# EAGLE design usbprog (EAGLE 4.16)
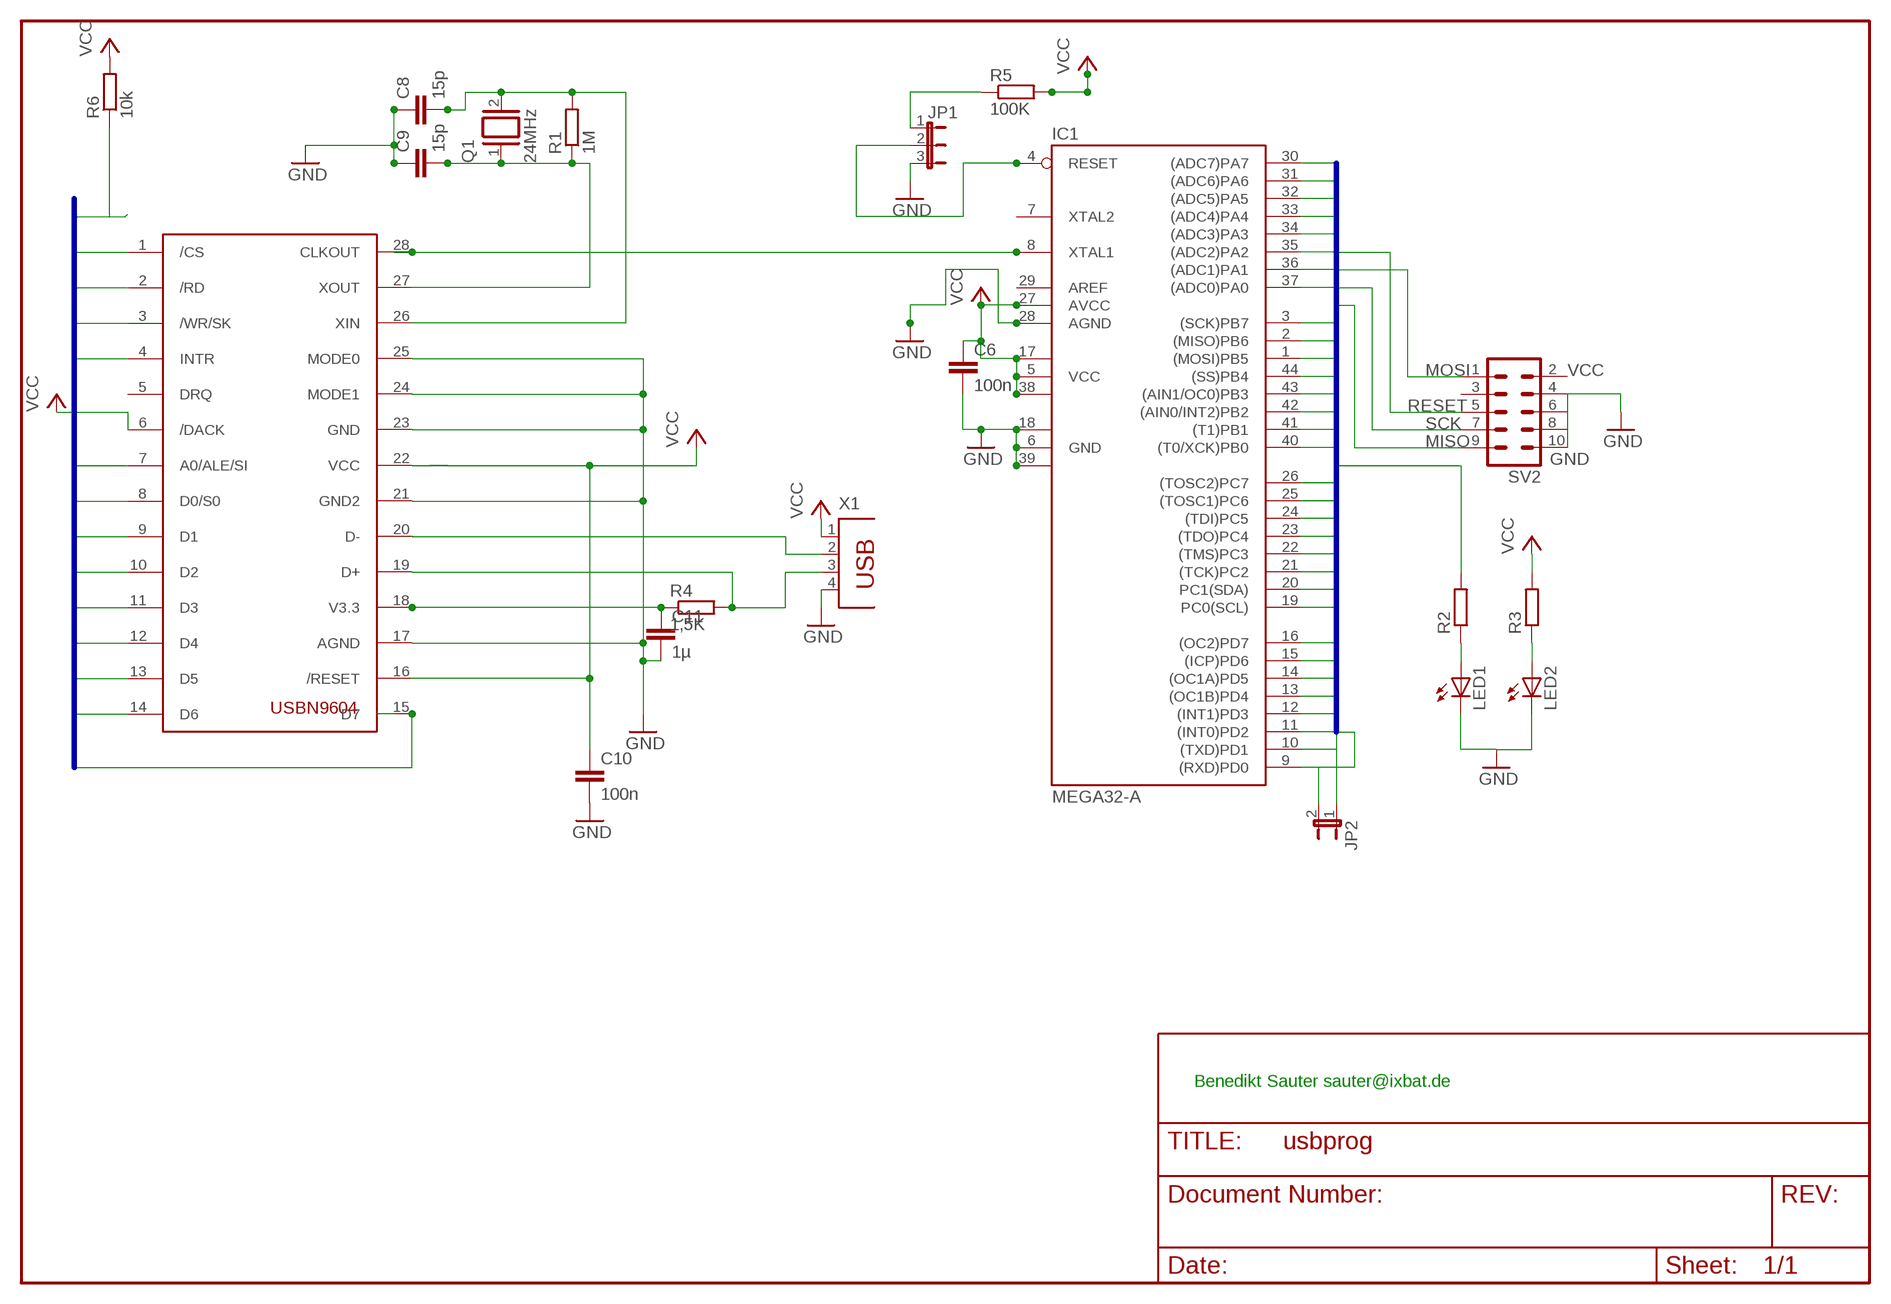
[diagram p0: schematic, sheet 1]

## Parts
C6  100n  C-EUC1206  [C1206]
C8  15p  C-EUC1206  [C1206]
C9  15p  C-EUC1206  [C1206]
C10  100n  C-EUC1206  [C1206]
C11  1µ  C-EUC1206  [C1206]
IC1  MEGA32-A  [TQFP44]
JP1  JP2E  [JP2]
JP2  JP1E  [JP1]
LED1  LEDCHIP-LED0805  [CHIP-LED0805]
LED2  LEDCHIP-LED0805  [CHIP-LED0805]
M1  USBN9604  [SO28-3]
Q1  24MHz  XTAL/S  [QS]
R1  1M  R-EU_R1206  [R1206]
R2  R-EU_M1206  [M1206]
R3  R-EU_M1206  [M1206]
R4  1,5K  R-EU_M1206  [M1206]
R5  100K  R-EU_R1206  [R1206]
R6  10k  R-EU_R1206  [R1206]
SV2  ML10L  [ML10L]
X1  PN61729  [PN61729]

## Nets
GND: C6.2 C8.1 C9.1 C10.2 C11.2 IC1.6(GND) IC1.18(GND1) IC1.28(AGND) IC1.39(GND2) JP1.3 LED1.C LED2.C M1.17(AGND) M1.21(GND2) M1.23(GND) M1.24(MODE1) M1.25(MODE0) SV2.4 SV2.6 SV2.8 SV2.10 X1.4
N$4: IC1.8(XTAL1) M1.28(CLKOUT)
N$5: JP1.1 R5.1
N$7: C11.1 M1.18(V3.3) R4.1
N$8: C8.2 M1.26(XIN) Q1.2 R1.2
N$9: LED1.A R2.1
N$10: LED2.A R3.1
N$11: C9.2 M1.27(XOUT) Q1.1 R1.1
N$12: M1.19(D+) R4.2 X1.3
N$15: M1.20(D-) X1.2
PA0: IC1.37((ADC0)PA0)
PA1: IC1.36((ADC1)PA1)
PA2: IC1.35((ADC2)PA2)
PA3: IC1.34((ADC3)PA3)
PA4: IC1.33((ADC4)PA4) R2.2
PA5: IC1.32((ADC5)PA5)
PA6: IC1.31((ADC6)PA6)
PA7: IC1.30((ADC7)PA7)
PB0: IC1.40((T0/XCK)PB0) SV2.5
PB1: IC1.41((T1)PB1)
PB2: IC1.42((AIN0/INT2)PB2)
PB3: IC1.43((AIN1/OC0)PB3)
PB4: IC1.44((SS)PB4)
PB5: IC1.1((MOSI)PB5) SV2.1
PB6: IC1.2((MISO)PB6) SV2.9
PB7: IC1.3((SCK)PB7) SV2.7
PC0: IC1.19(PC0(SCL)) M1.8(D0/S0)
PC1: IC1.20(PC1(SDA)) M1.9(D1)
PC2: IC1.21((TCK)PC2) M1.10(D2)
PC3: IC1.22((TMS)PC3) M1.11(D3)
PC4: IC1.23((TDO)PC4) M1.12(D4)
PC5: IC1.24((TDI)PC5) M1.13(D5)
PC6: IC1.25((TOSC1)PC6) M1.14(D6)
PC7: IC1.26((TOSC2)PC7) M1.15(D7)
PD0: IC1.9((RXD)PD0) JP2.2
PD1: IC1.10((TXD)PD1) JP2.1
PD2: IC1.11((INT0)PD2) M1.4(INTR) R6.1
PD3: IC1.12((INT1)PD3) M1.1(/CS)
PD4: IC1.13((OC1B)PD4) M1.2(/RD)
PD5: IC1.14((OC1A)PD5) M1.3(/WR/SK)
PD6: IC1.15((ICP)PD6) M1.7(A0/ALE/SI)
PD7: IC1.16((OC2)PD7)
RESET: IC1.4(RESET) JP1.2
VCC: C6.1 C10.1 IC1.5(VCC) IC1.17(VCC1) IC1.27(AVCC) IC1.38(VCC2) M1.6(/DACK) M1.16(/RESET) M1.22(VCC) R3.2 R5.2 R6.2 X1.1
Unconnected: IC1.7(XTAL2) M1.5(DRQ) SV2.2 SV2.3

## Buses
PD0,PD1,PD2,PD3,PD4,PD5,PD6,PD7,PC0,PC1,PC2,PC3,PC4,PC5,PC6,PC7,PB0,PB1,PB2,PB3,PB4,PB5,PB6,PB7,PA0,PA1,PA2,PA3,PA4,PA5,PA6,PA7

## Notes on the sheet
- MOSI | VCC
- RESET
- SCK
- MISO
- GND
- Benedikt Sauter sauter@ixbat.de

## Power pins joined to a net without a drawn wire
AREF: IC1.29(AREF)

## Library data of the parts
C6 C8-C11 = rcl:C-EU: CAPACITOR, European symbol
IC1 = avr:MEGA32: MICROCONTROLLER 32 Kbytes FLASH 2 Kbytes SRAM 1 Kbytes EEPROM USART 8-channel 10 bit ADC
JP1 = jumper:JP2E: JUMPER
JP2 = jumper:JP1E: JUMPER
LED1 LED2 = led:LED: LED OSRAM: - CHIPLED LG R971, LG N971, LY N971, LG Q971, LY Q971, LO R971, LY R971 LH N974, LH R974 LS Q976, LO Q976, LY Q976 LO Q996 - Hyper CHIPLED LW Q18S LB Q993, LB Q99A, LB R99A - SideLED LS A670, LO A670, LY A670, LG A670, LP A670 LB A673, LV A673, LT A673, LW A673 LH A674 LY A675 LS A676, LA A676, LO A676, LY A676, LW A676 LS A679, LY A679, LG A679 - Hyper Micro SIDELED® LS Y876, LA Y876, LO Y876, LY Y876 LT Y87S - SmartLED LW L88C, LW L88S LB L89C, LB L89S, LG L890 LS L89K, LO L89K, LY L89K LS L896, LA L896, LO L896, LY L896 - TOPLED LS T670, LO T670, LY T670, LG T670, LP T670 LSG T670, LSP T670, LSY T670, LOP T670, LYG T670 LG T671, LOG T671, LSG T671 LB T673, LV T673, LT T673, LW T673 LH T674 LS T676, LA T676, LO T676, LY T676, LB T676, LH T676, LSB T676, LW T676 LB T67C, LV T67C, LT T67C, LS T67K, LO T67K, LY T67K, LW E67C LS E67B, LA E67B, LO E67B, LY E67B, LB E67C, LV E67C, LT E67C LW T67C LS T679, LY T679, LG T679 LS T770, LO T770, LY T770, LG T770, LP T770 LB T773, LV T773, LT T773, LW T773 LH T774 LS E675, LA E675, LY E675, LS T675 LS T776, LA T776, LO T776, LY T776, LB T776 LHGB T686 LT T68C, LB T68C - Hyper Mini TOPLED® LB M676 - Mini TOPLED Santana® LG M470 LS M47K, LO M47K, LY M47K Source: http://www.osram.convergy.de/
M1 = bene:USBN9604
Q1 = special:XTAL/S: CRYSTAL
R1-R6 = rcl:R-EU_: RESISTOR, European symbol
SV2 = con-harting-ml:ML10: HARTING
X1 = con-berg:PN61729: BERG USB connector

## Board
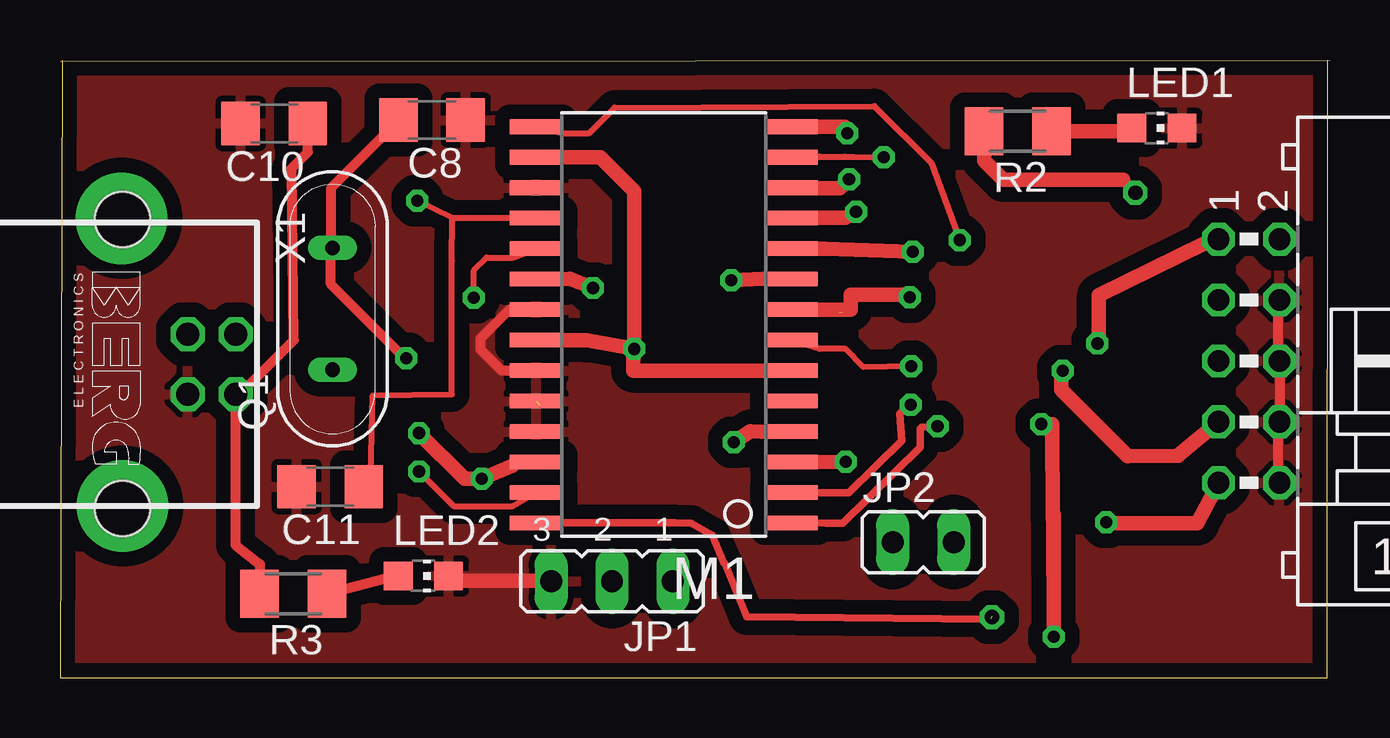
[diagram p1: board, top side]
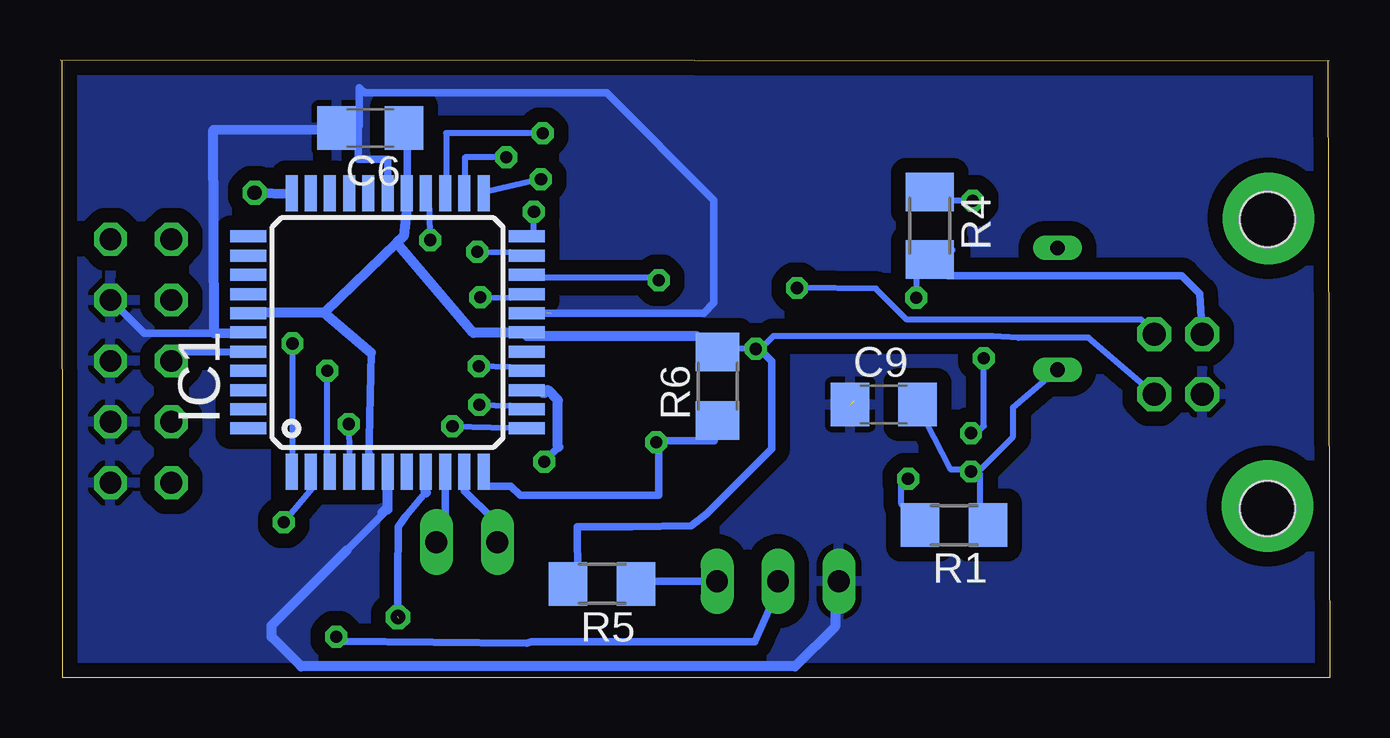
[diagram p2: board, bottom side, seen from below]

Size 52.92 x 25.75 mm. Coordinates in mm from the lower left corner, seen from the top.
Outline: 52.82,25.73 52.8,0 0,0.01 0.1,25.73
Outline: 0.03,25.7 52.92,25.75
Copper layers (1*16): Top 0.035mm / dielectric 1.5mm / Bottom 0.035mm
Design rules "ZWILLING": minimum track width 8mil, minimum drill 20mil, track to track 8mil, track to pad 8mil, pad to pad 8mil, via to via 8mil, smd to smd 0mil, copper to edge 10mil, drill to drill 10mil, minimum pad ring 8mil, minimum via ring 8mil, stop-mask expansion 4mil, vias tented up to drill 0mil, thermal gap 10mil

### Footprints (pad centres in the part's own frame; a part is rotated, then mirrored left to right if it is on the bottom)
C1206 = smd 1.6 x 1.8: 1 -1.4,0; 2 1.4,0
TQFP44 = smd 1.5 x 0.5: 1 -5.8,4; 2 -5.8,3.2; 3 -5.8,2.4; 4 -5.8,1.6; 5 -5.8,0.8; 6 -5.8,0; 7 -5.8,-0.8; 8 -5.8,-1.6; 9 -5.8,-2.4; 10 -5.8,-3.2; 11 -5.8,-4; 23 5.8,-4; 24 5.8,-3.2; 25 5.8,-2.4; 26 5.8,-1.6; 27 5.8,-0.8; 28 5.8,0; 29 5.8,0.8; 30 5.8,1.6; 31 5.8,2.4; 32 5.8,3.2; 33 5.8,4 | smd 0.5 x 1.5: 12 -4,-5.8; 13 -3.2,-5.8; 14 -2.4,-5.8; 15 -1.6,-5.8; 16 -0.8,-5.8; 17 0,-5.8; 18 0.8,-5.8; 19 1.6,-5.8; 20 2.4,-5.8; 21 3.2,-5.8; 22 4,-5.8; 34 4,5.8; 35 3.2,5.8; 36 2.4,5.8; 37 1.6,5.8; 38 0.8,5.8; 39 0,5.8; 40 -0.8,5.8; 41 -1.6,5.8; 42 -2.4,5.8; 43 -3.2,5.8; 44 -4,5.8
JP2 = drill 0.914 long: 1 -2.54,0; 2 0,0; 3 2.54,0
JP1 = drill 0.914 long: 1 0,-1.27; 2 0,1.27
CHIP-LED0805 = smd 1.2 x 1.2: A 0,-1.05; C 0,1.05
SO28-3 = smd 0.61 x 2.21: 1 -8.255,-5.315; 2 -6.985,-5.315; 3 -5.715,-5.315; 4 -4.445,-5.315; 5 -3.175,-5.315; 6 -1.905,-5.315; 7 -0.635,-5.315; 8 0.635,-5.315; 9 1.905,-5.315; 10 3.175,-5.315; 11 4.445,-5.315; 12 5.715,-5.315; 13 6.985,-5.315; 14 8.255,-5.315; 15 8.255,5.315; 16 6.985,5.315; 17 5.715,5.315; 18 4.445,5.315; 19 3.175,5.315; 20 1.905,5.315; 21 0.635,5.315; 22 -0.635,5.315; 23 -1.905,5.315; 24 -3.175,5.315; 25 -4.445,5.315; 26 -5.715,5.315; 27 -6.985,5.315; 28 -8.255,5.315
QS = drill 0.61 long: 1 -2.54,0; 2 2.54,0
R1206 = smd 1.6 x 1.803: 1 -1.422,0; 2 1.422,0
M1206 = smd 1.6 x 2: 1 -1.4,0; 2 1.4,0
ML10L = drill 0.914 octagon: 1 -5.08,-1.27; 2 -5.08,1.27; 3 -2.54,-1.27; 4 -2.54,1.27; 5 0,-1.27; 6 0,1.27; 7 2.54,-1.27; 8 2.54,1.27; 9 5.08,-1.27; 10 5.08,1.27
PN61729 = drill 0.95 octagon: 1 1.25,4.71; 2 -1.25,4.71; 3 -1.25,2.71; 4 1.25,2.71 | hole 2.3: -6.02,0; 6.02,0

### Placement (x,y rotation side)
C6  39.99,22.92 180 bottom
C8  15.5,23.25 180 top
C9  18.59,11.39 0 bottom
C10  8.92,23.11 180 top
C11  11.26,7.97 180 top
IC1  39.27,14.4 90 bottom
JP1  23,4.03 180 top
JP2  35.96,5.66 270 top
LED1  45.7,22.91 270 top
LED2  15.14,4.25 270 top
M1  25.15,14.71 90 top
Q1  11.35,15.38 90 top
R1  15.66,6.37 180 bottom
R2  39.9,22.78 180 top
R3  9.72,3.51 180 top
R4  16.67,18.84 270 bottom
R5  30.33,3.92 180 bottom
R6  25.52,12.16 90 bottom
SV2  49.54,13.21 270 top
X1  2.61,13.08 270 top

### Tracks (layer width: path | path; a pad name or v marks a point on that pad's centre or on a via)
GND  (2 unrouted)
  Top 0.305: 16.4,4.05 16.19,4.2 16.16,4.24 LED2.C | JP1.3 20.48,4.03 20.48,4.05
  Top 0.406: 50.77,13.21 50.77,13.14 | 50.77,13.21 SV2.6 50.85,13.21 50.85,10.67 SV2.8 50.77,10.67 50.77,8.13 SV2.10 | SV2.4 50.77,15.75 50.77,13.21 | M1.21 18.73,15.35 17.53,14.15 17.53,13.68 18.4,12.8 19.8,12.8 19.81,12.81 M1.23
  Top 0.61: 16.4,4.05 20.48,4.05
  Bottom 0.254: 32.64,15.23 32.79,15.23 IC1.18 | 39.27,7.77 39.27,7.92 IC1.6 | 32.44,15.2 32.41,15.23
  Bottom 0.305: 39.27,9 IC1.6 39.27,7.17 39.53,6.91 39.53,6.76 43.09,3.19 | SV2.4 50.78,15.75 49.4,14.37 46.49,14.37 | IC1.18 26.1,15.2 25.67,15.63 25.67,19.91 30.13,24.38 40.22,24.38 40.45,24.6 40.45,23.04 40.52,22.86 | 40.52,22.86 40.65,22.85 | 40.97,5.32 39.27,7.02 | 40.52,22.86 40.48,22.86 40.48,21.62 39.26,21.62 IC1.28
  Bottom 0.406: IC1.39 46.49,14.37 46.52,22.84 41.1,22.87 C6.2 | 39.27,7.02 39.27,9 | 40.97,5.32 44.09,2.19 44.09,1.71 42.87,0.48 22.28,0.48 20.62,2.14 20.62,3.75 20.44,3.93 20.46,3.95 JP1.3
  pour Bottom (isolate 0.61): 0.23,26.26 53.64,26.32 52.91,-0.51 -0.06,-0.5
  pour Top (isolate 0.61): 0.08,26.19 53.2,26.27 53.25,-0.54 0.01,-0.33
N$1  (via drill 1.6 pad 3.81)
  other vias: 2.57,19.15
N$2  (via drill 1.6 pad 3.81)
  other vias: 2.61,7.16
N$4  (1 unrouted)
  Top 0.305: 38.79,2.48 38.76,2.44 28.62,2.54 27.72,4.75 27.66,4.8 27.18,5.94 26.3,6.45 25.63,6.46 M1.28
  Bottom 0.305: 37.67,7.73 38.54,6.72 38.82,6.31 38.84,4.17 38.85,2.57
  Bottom 0.406: 37.67,7.73 IC1.8
N$5
  Bottom 0.305: R5.1 28.84,4.13 28.74,4.03 JP1.1
N$6  (via drill 0.6)
  other vias: 38.83,2.54
N$7  (via drill 0.51)
  Top 0.254: 16.33,19.17 17.71,19.17 18.77,19.17 M1.18 | 16.33,19.17 16.33,17.37 16.33,11.81 13.03,11.78 12.95,8.5 C11.1 | 16.33,19.17 v14.88,19.88
  Bottom 0.254: v14.88,19.88 15.72,19.88 R4.1
N$8  (via drill 0.51)
  Top 0.254: 18.85,8.85 19.19,9.16 M1.26 | Q1.2 11.31,17.97 | v17.58,8.3 17.7,8.3
  Top 0.406: v14.42,13.33 14.37,13.33 11.29,16.41 11.29,17.9 11.27,17.92 | 11.27,17.92 11.26,17.93 | 11.27,17.92 Q1.2 | C8.2 14.1,23.22 11.31,20.43 11.31,17.97
  Top 0.61: v17.58,8.3 18.85,8.85 | 17.7,8.3 16.86,8.3 v14.96,10.2
  Bottom 0.254: v17.58,8.3 17.85,8.07 17.85,7.23 R1.2 | v14.96,10.2 14.73,10.2 14.42,10.51 v14.42,13.33
N$9
  Top 0.406: 44.26,22.81 44.26,22.91 LED1.A 44.49,22.91 44.36,22.78
  Top 0.61: R2.1 44.36,22.78
N$10
  Top 0.406: LED2.A 13.86,4.25 13.96,4.26 R3.1
N$11  (via drill 0.51)
  Top 0.254: v14.96,8.6 16.41,7.16 18.84,7.16 M1.27
  Bottom 0.254: 14.96,8.68 14.73,8.68 14.58,8.53 14.58,7.23 R1.1 | 14.96,8.68 15.8,8.68 C9.2 | 14.96,8.68 v14.96,8.6 14.58,8.68 13.2,10.05 13.2,11.27 Q1.1
N$12  (via drill 0.51)
  Top 0.254: v17.24,15.84 17.24,16.99 17.78,17.52 18.84,17.52 M1.19
  Bottom 0.254: v17.24,15.84 17.24,16.68 R4.2 15.72,17.82
  Bottom 0.305: X1.3 5.43,16.01 6.17,16.75 15.92,16.75 16.62,17.46 16.64,17.44 R4.2
N$15  (via drill 0.51)
  Top 0.61: v22.21,16.25 21.24,16.64 M1.20
  Bottom 0.254: v22.21,16.25 18.92,16.22 17.62,14.93 7.87,14.93 X1.2
PA4  (via drill 0.6)
  Top 0.305: v44.8,20.22 44.8,20.55
  Top 0.406: v44.8,20.22 44.8,20.26 44.31,20.75
  Top 0.61: R2.2 38.5,21.55 39.31,20.75 44.31,20.75
  Bottom 0.406: IC1.33 43.27,20.18 v44.8,20.22
PB0
  Bottom 0.254: 45.74,13.48 IC1.40
  Bottom 0.305: IC1.40 45.25,13.6 48.31,13.57 SV2.5
PB5  (via drill 0.51)
  Top 0.406: 47.69,18.12 SV2.1 | v43.23,13.94 43.23,13.96 43.19,14 43.29,14.09
  Top 0.61: 47.69,18.12 43.29,15.94 43.29,14.09
  Bottom 0.254: v43.23,13.94 43.23,9.29 IC1.1
PB6  (via drill 0.51)
  Top 0.305: 43.55,6.49 43.58,6.52 | v43.59,6.49 43.55,6.49 | 43.61,6.45 43.63,6.51 43.55,6.49
  Top 0.61: SV2.9 47.39,6.44 43.61,6.45
  Bottom 0.254: v43.59,6.49 42.39,7.92 IC1.2
PB7  (via drill 0.51)
  Top 0.305: 41.7,12.8 41.69,12.8 | v41.78,12.8 41.7,12.8 | 41.7,12.8 41.72,12.77
  Top 0.406: 46.59,9.26 46.59,9.29
  Top 0.61: 46.59,9.29 SV2.7 | 41.72,12.77 41.72,12.02 44.49,9.25 46.59,9.26
  Bottom 0.254: v41.78,12.8 41.78,9.29 IC1.3
PC0  (via drill 0.51)
  Top 0.61: M1.8 32.94,15.35 32.94,15.96 35.48,15.96 35.48,15.87 v35.4,15.87
  Bottom 0.254: v35.4,15.87 34.16,15.84 IC1.19
PC1  (via drill 0.51)
  Top 0.61: v27.97,16.57 29.32,16.64 M1.9
  Bottom 0.254: v27.97,16.57 28.14,16.68 32.79,16.68 IC1.20
PC2  (via drill 0.51)
  Top 0.61: v35.53,17.76 31.86,17.89 M1.10
  Bottom 0.254: v35.53,17.76 34.16,17.75 IC1.21
PC3  (via drill 0.51)
  Top 0.254: 31.65,19.18 M1.11
  Top 0.61: v33.17,19.42 32.71,19.18 31.65,19.18
  Bottom 0.254: v33.17,19.42 33.17,18.59 IC1.22
PC4  (via drill 0.51)
  Top 0.254: 31.42,20.42 31.34,20.34 M1.12
  Top 0.305: 32.85,20.78 v32.88,20.78
  Top 0.61: 31.42,20.42 32.49,20.42 32.85,20.78
  Bottom 0.254: v32.88,20.78 35.31,20.23 IC1.23
PC5  (via drill 0.51)
  Top 0.254: v34.32,21.69 33.09,21.71 32.71,21.72 31.65,21.72 M1.13
  Bottom 0.254: v34.32,21.69 36.05,21.69 IC1.24
PC6  (via drill 0.51)
  Top 0.61: v32.8,22.7 32.7,22.97 M1.14
  Bottom 0.254: v32.8,22.7 36.83,22.7 36.83,20.87 IC1.25
PC7  (via drill 0.51)
  Top 0.254: v37.49,18.25 36.29,21.46 33.93,23.82 23.11,23.77 22.04,22.7 20.98,22.7 M1.15
  Bottom 0.254: v37.49,18.25 37.51,19.5 IC1.26
PD0
  Bottom 0.305: IC1.9 36.87,6.75 37.28,6.34 37.28,5.72 37.23,5.68 JP2.2
PD1
  Bottom 0.305: IC1.10 36.07,7.81 34.87,6.61 34.87,5.94 34.67,5.74 34.69,5.71 JP2.1
PD2  (via drill 0.51)
  Top 0.305: 29.25,10.27 M1.4
  Top 0.61: v28.07,9.82 28.76,10.27 29.25,10.27
  Bottom 0.254: 35.07,7.99 IC1.11
  Bottom 0.305: v28.07,9.82 27.97,9.73 27.96,8.73 27.96,7.6 33.74,7.6 34.13,7.99 35.07,7.99 | 25.24,10.58 25.39,10.73 R6.1 25.66,10.73 25.66,9.89 27.87,9.89
  Bottom 0.406: 27.96,9.83 27.87,9.89 v28.07,9.82 | R6.1 25.47,10.73
PD3  (via drill 0.51)
  Top 0.305: M1.1 31.93,6.45 32.61,6.45 35.85,9.62 35.85,10.38 35.91,10.44 | 35.91,10.44 35.92,10.45 | 35.91,10.44 v36.56,10.49
  Bottom 0.254: v36.56,10.49 34.16,10.43 IC1.12
PD4  (via drill 0.51)
  Top 0.254: M1.2 31.66,7.72
  Top 0.305: 31.66,7.72 32.87,7.72 35.07,9.89 34.98,11 35.37,11.38 v35.45,11.38
  Bottom 0.254: v35.45,11.38 34.16,11.35 IC1.13
PD5  (via drill 0.51)
  Top 0.254: 32.66,9.01 v32.73,9.01
  Top 0.61: M1.3 32.66,9.01
  Bottom 0.254: 32.79,11.88 IC1.14
  Bottom 0.305: v32.73,9.01 32.41,9.36 32.14,9.63
  Bottom 0.406: 32.14,9.63 32.17,9.63 32.17,11.57 32.6,12.01 32.73,11.88 32.79,11.88
PD6  (via drill 0.51)
  Top 0.254: v35.47,12.98 33.47,12.95 32.71,13.71 31.65,13.71 M1.7
  Bottom 0.254: v35.47,12.98 34.16,12.95 IC1.15
RESET  (via drill 0.51)
  Top 0.305: 41.38,6.77 41.36,6.64
  Top 0.406: 41.33,10.58 41.37,10.58
  Top 0.61: 41.4,6.82 v41.41,1.71 41.38,6.77 | v40.88,10.58 41.33,10.58 41.36,6.64
  Bottom 0.254: v40.88,10.58 40.87,9.29 IC1.4
  Bottom 0.305: JP1.2 23,3.65 23.97,1.52 33.28,1.52 33.46,1.45 41.25,1.54
  Bottom 0.406: v41.41,1.71 41.37,1.71 41.37,1.54 41.25,1.54
VCC  (via drill 0.51)
  Top 0.305: 23.8,13.71 23.77,13.68 | v23.93,13.71 23.8,13.71 | 23.8,13.71 23.93,13.83
  Top 0.406: R3.2 8.33,4.74 7.32,5.53 X1.1 7.55,11.88 9.74,14.07 9.66,21.24 10.32,21.91 C10.1 | v23.93,13.71 23.88,13.71
  Top 0.61: v23.93,13.71 21.94,14.07 M1.22 | M1.16 22.5,21.7 23.93,20.27 23.93,13.83 | M1.6 23.88,12.81 23.88,13.71
  Bottom 0.254: 44.57,15.21 IC1.38 | 38.44,19.56 IC1.27 | IC1.5 39.98,9.12 39.95,9.29 | 32.79,14.24 IC1.17 33.49,14.38 | 26.39,14.24 R6.2 24.63,13.71 v23.93,13.71 23.49,13.94 23.19,14.24 14.04,14.24 12.97,14.17 10.07,14.18 X1.1
  Bottom 0.305: 39.98,9.12 40.05,9.12 40.07,9.13 40.05,9.06 39.95,13.56 | R5.2 31.35,4.13 31.36,6.31 29.1,6.31 26.61,6.34 25.97,6.85 23.26,9.56 23.26,13.19 23.81,13.74 23.84,13.71 v23.93,13.71 | IC1.27 38.45,20.2 38.45,22.92 C6.1
  Bottom 0.406: 41.91,15.21 44.57,15.21 | 38.88,18.13 38.58,18.43 38.44,19.56 | 38.88,18.13 41.91,15.21 | 41.91,15.21 39.95,13.56 | 33.49,14.38 35.69,14.38 38.88,18.13 | 33.45,14.4 33.45,14.42 | 33.45,14.4 IC1.17 | 26.39,14.24 33.45,14.24 33.45,14.4

### Text on the board
tDocu: MOSI | usbprog | B. Sauter | RESET | SCK | MISO | www.ixbat.de | prog